# Altium schematic sheet 6_laser driver.SchDoc
size A4; SheetNumber: 6; SheetTotal: 7
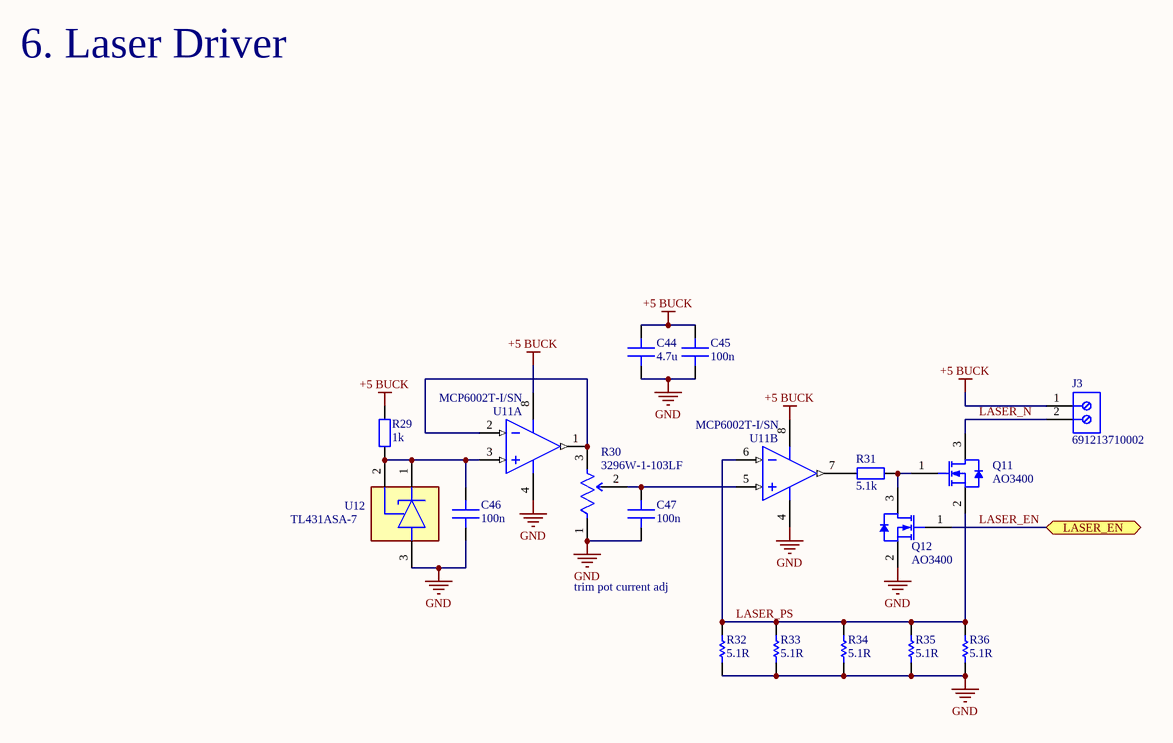
[diagram p0: 6_laser driver.SchDoc]

## Parts
C44  4.7u  [IPC C C0603 NO SILK]
C45  100n  [IPC C C0402 NO SILK]
C46  100n  [IPC C C0402 NO SILK]
C47  100n  [IPC C C0402 NO SILK]
J3  691213710002  [691213710002]
Q11  AO3400  [AO-SOT23-3_V]
Q12  AO3400  [AO-SOT23-3_V]
R29  1k  [IPC C R0402 NO SILK]
R30  3296W-1-103LF  [FP-3296W-MFG]
R31  5.1k  [IPC C R0402 NO SILK]
R32  5.1R  [RESC2013X70X40LL20T20]
R33  5.1R  [RESC2013X70X40LL20T20]
R34  5.1R  [RESC2013X70X40LL20T20]
R35  5.1R  [RESC2013X70X40LL20T20]
R36  5.1R  [RESC2013X70X40LL20T20]
U11  MCP6002T-I/SN  [SOIC-SN8_N]  (parts A,B of 2)
U12  TL431ASA-7  [FP-SOT23-MFG]

## Ports
LASER_EN (bidir, see 2_mcu[4C])

## Nets
+5 BUCK: C44.2 C45.2 J3.1 R29.2 U11.8(VDD)
GND: C44.1 C45.1 C46.1 C47.1 Q12.2(S) R30.1(CCW) R32.1 R33.1 R34.1 R35.1 R36.1 U11.4(VSS) U12.3(A)
LASER_EN: Q12.1(G) ; port LASER_EN
LASER_N: J3.2 Q11.3(D)
LASER_PS: Q11.2(S) R32.2 R33.2 R34.2 R35.2 R36.2 U11.6(VINB-)
NetC46_2: C46.2 R29.1 U11.3(VINA+) U12.1(C) U12.2(REF)
NetC47_2: C47.2 R30.2(WIPER) U11.5(VINB+)
NetQ11_1: Q11.1(G) Q12.3(D) R31.2
NetR30_3: R30.3(CW) U11.1(VOUTA) U11.2(VINA-)
NetR31_1: R31.1 U11.7(VOUTB)

## Notes on the sheet
- 6. Laser Driver
- trim pot current adj

## Library data of the parts
C44 = Generic CAP 0603: Value: 4.7u
C45-C47 = Generic CAP 0402: Value: 100n
J3 = CMP-1502-02526-2: NexarPartId: 8917718; Number of Contacts: 2; Current Rating: 10A; Stripping Length: -7mm; Wire Gauge (Max): 26AWG; Plating: Brass, Steel; Wire Gauge (Min): 16AWG; Voltage: 300V; Number of Levels: 1; Pitch: 5.0038mm; Color: Green; Number of Pins: 2; Housing Material: Nylon; Termination: Screw; Max Operating Temperature: 105°C; Min Operating Temperature: -40°C; Packaging: Box; Current: 10A; REACH SVHC: Unknown; Width: 10.6mm; RoHS: Compliant; Mount: Through Hole; Height: 10mm; Contact Material: Brass; Length: 8.3mm; Lead Pitch: 5mm; Wire/Cable Gauge: 26AWG; Voltage Rating: 300V; Number of Positions Per Level: 2; Contact Plating: Tin
Q11 Q12 = CMP-0278-00001-1: N-channel Enhancement Mode Field-Effect Transistor; 5.8A/30V; Manufacturer: Alpha and Omega; Channel Type: N; Drain-Source Voltage Limit: 30 V; Junction Temperature: -55 to 150 degC; Gate-Source Voltage Limit: +/-12 V; PackageDescription: 3-Pin SOT23, 3.016 x 2.8 mm Body, 0.95 mm Pitch; ComponentLink2Description: Datasheet; DatasheetVersion: Rev.8, 12/2011; ComponentLink3URL: http://www.aosmd.com/res/packaging_information/SOT-23.pdf; Storage Temperature: -55 to 150 degC; ComponentLink3Description: Package Specification; PackageReference: SOT23; ComponentLink1Description: Manufacturer URL; Mounting Technology: Surface Mount; ComponentLink1URL: http://www.aosmd.com/; PartNumber: AO3400; ComponentLink2URL: http://www.aosmd.com/res/data_sheets/AO3400.pdf
R29 R31 = Generic RES 0402
  R29: Value: 1k
  R31: Value: 5.1k
R30 = CMP-1747-00001-8: TRIMMER 10K OHM 0.5W PC PIN TOP; Number of Turns: 25; Tolerance: 10%; Resistance: 10kR; Max Power Dissipation: 500mW; Temperature Coefficient: 100ppm/°C; Insulation Resistance: 1GR; Min Operating Temperature: -55°C; Resistor Type: Cermet; Series: 3296; Color: Blue; Mount: Through Hole; Taper: Linear; Radiation Hardening: No; RoHS Compliant: Yes; Width: 9.53mm; Resistance Tolerance: 10%; Contact Plating: Tin; Military Standard: Not; Package Quantity: 50; Weight: 0.03oz; Lead Free: Lead Free; Power Rating: 500mW; Termination: Pin; Technology: CERMET; Max Operating Temperature: 125°C; Packaging: Rail/Tube; Length: 9.53mm; Depth: 4.83mm; Height: 11.55mm; Reach SVHC Compliant: Yes
R32-R36 = CMP-2001-00435-1: Part Number: ERJ-6GEYJ5R1V; Manufacturer: Panasonic
U11 = CMP-0187-00288-3: None; Supply Current: 100uA; Number of Circuits: 2; Operating Supply Voltage: 5.5V; Min Supply Voltage: 1.8V; Input Offset Voltage-Max: 4.5mV; Common Mode Rejection Ratio: 60dB; Slew Rate: 0.6V/µs; Output Current: 23mA; Max Frequency: 1kHz; Max Supply Voltage: 6V; Unity Gain Bandwidth Product: 1MHz; Amplifier Type: GENERAL PURPOSE; Voltage Gain: 112dB; Input Bias Current: 1pA; Power Supply Rejection Ratio (PSRR): 86dB; Packaging: Tape and Reel; Case/Package: SOIC; Operating Supply Current: 100uA; Radiation Hardening: No; Number of Elements: 2; Number of Channels: 2; Height: 1.5mm; Min Operating Temperature: -40°C; Slew Rate-Nom: 0.6V/µs; Max Operating Temperature: 85°C; Mount: Surface Mount; Output Current per Channel: 23mA; Series: -; Gain Bandwidth Product: 1MHz; Length: 8.65mm; Technology: CMOS; Number of Pins: 8; Input Offset Voltage (Vos): 4.5mV; Width: 3.9mm; Package Quantity: 3300; Nominal Supply Current: 100uA; Lead Free: Lead Free; RoHS Compliant: Yes
U12 = CMP-12755-000001-1: IC VREF SHUNT ADJ SOT23-3; Manufacturer: DIODES INC.; Standoff Height: 0.013mm; Max Power Dissipation: 330mW; Max Junction Temp: +150°C; Output Type: AdjustableProgrammable; Octopart: https://octopart.com/tl431asa-7-diodes+inc.-18832779; Automotive: No; Digikey Description: IC VREF SHUNT ADJ SOT23-3; Temperature: to +150°C; Ambient Temperature Range High: +125°C; Ipc Land Pattern Name: SOT92P240X102-3; ComponentLink2URL: https://www.diodes.com/assets/Datasheets/TL431_432.pdf; RoHS: TRUE; Manufacturer Part Number: TL431ASA-7; Reference Type: Shunt; Mouser Description: V-Ref Adjustable 2.495V to 36V 100mA 3-Pin SOT-23 T/R; Package: SOT23; Ambient Temperature Range Low: -40°C; Device Class L3: Voltage References; Temperature Range High: +150°C; ComponentLink2Description: Datasheet; Footprint Url: https://www.diodes.com/assets/Package-Files/SOT23.pdf; Category: IC; Device Class L2: Power Management ICs; Device Class L1: Integrated Circuits (ICs); Lead Free: Yes; Height: 1.1mm